# Altium schematic sheet TECS_DRIVER.SchDoc: TEC_DRIVER
size 420 x 297 mm; SheetNumber: 7; SheetTotal: 12
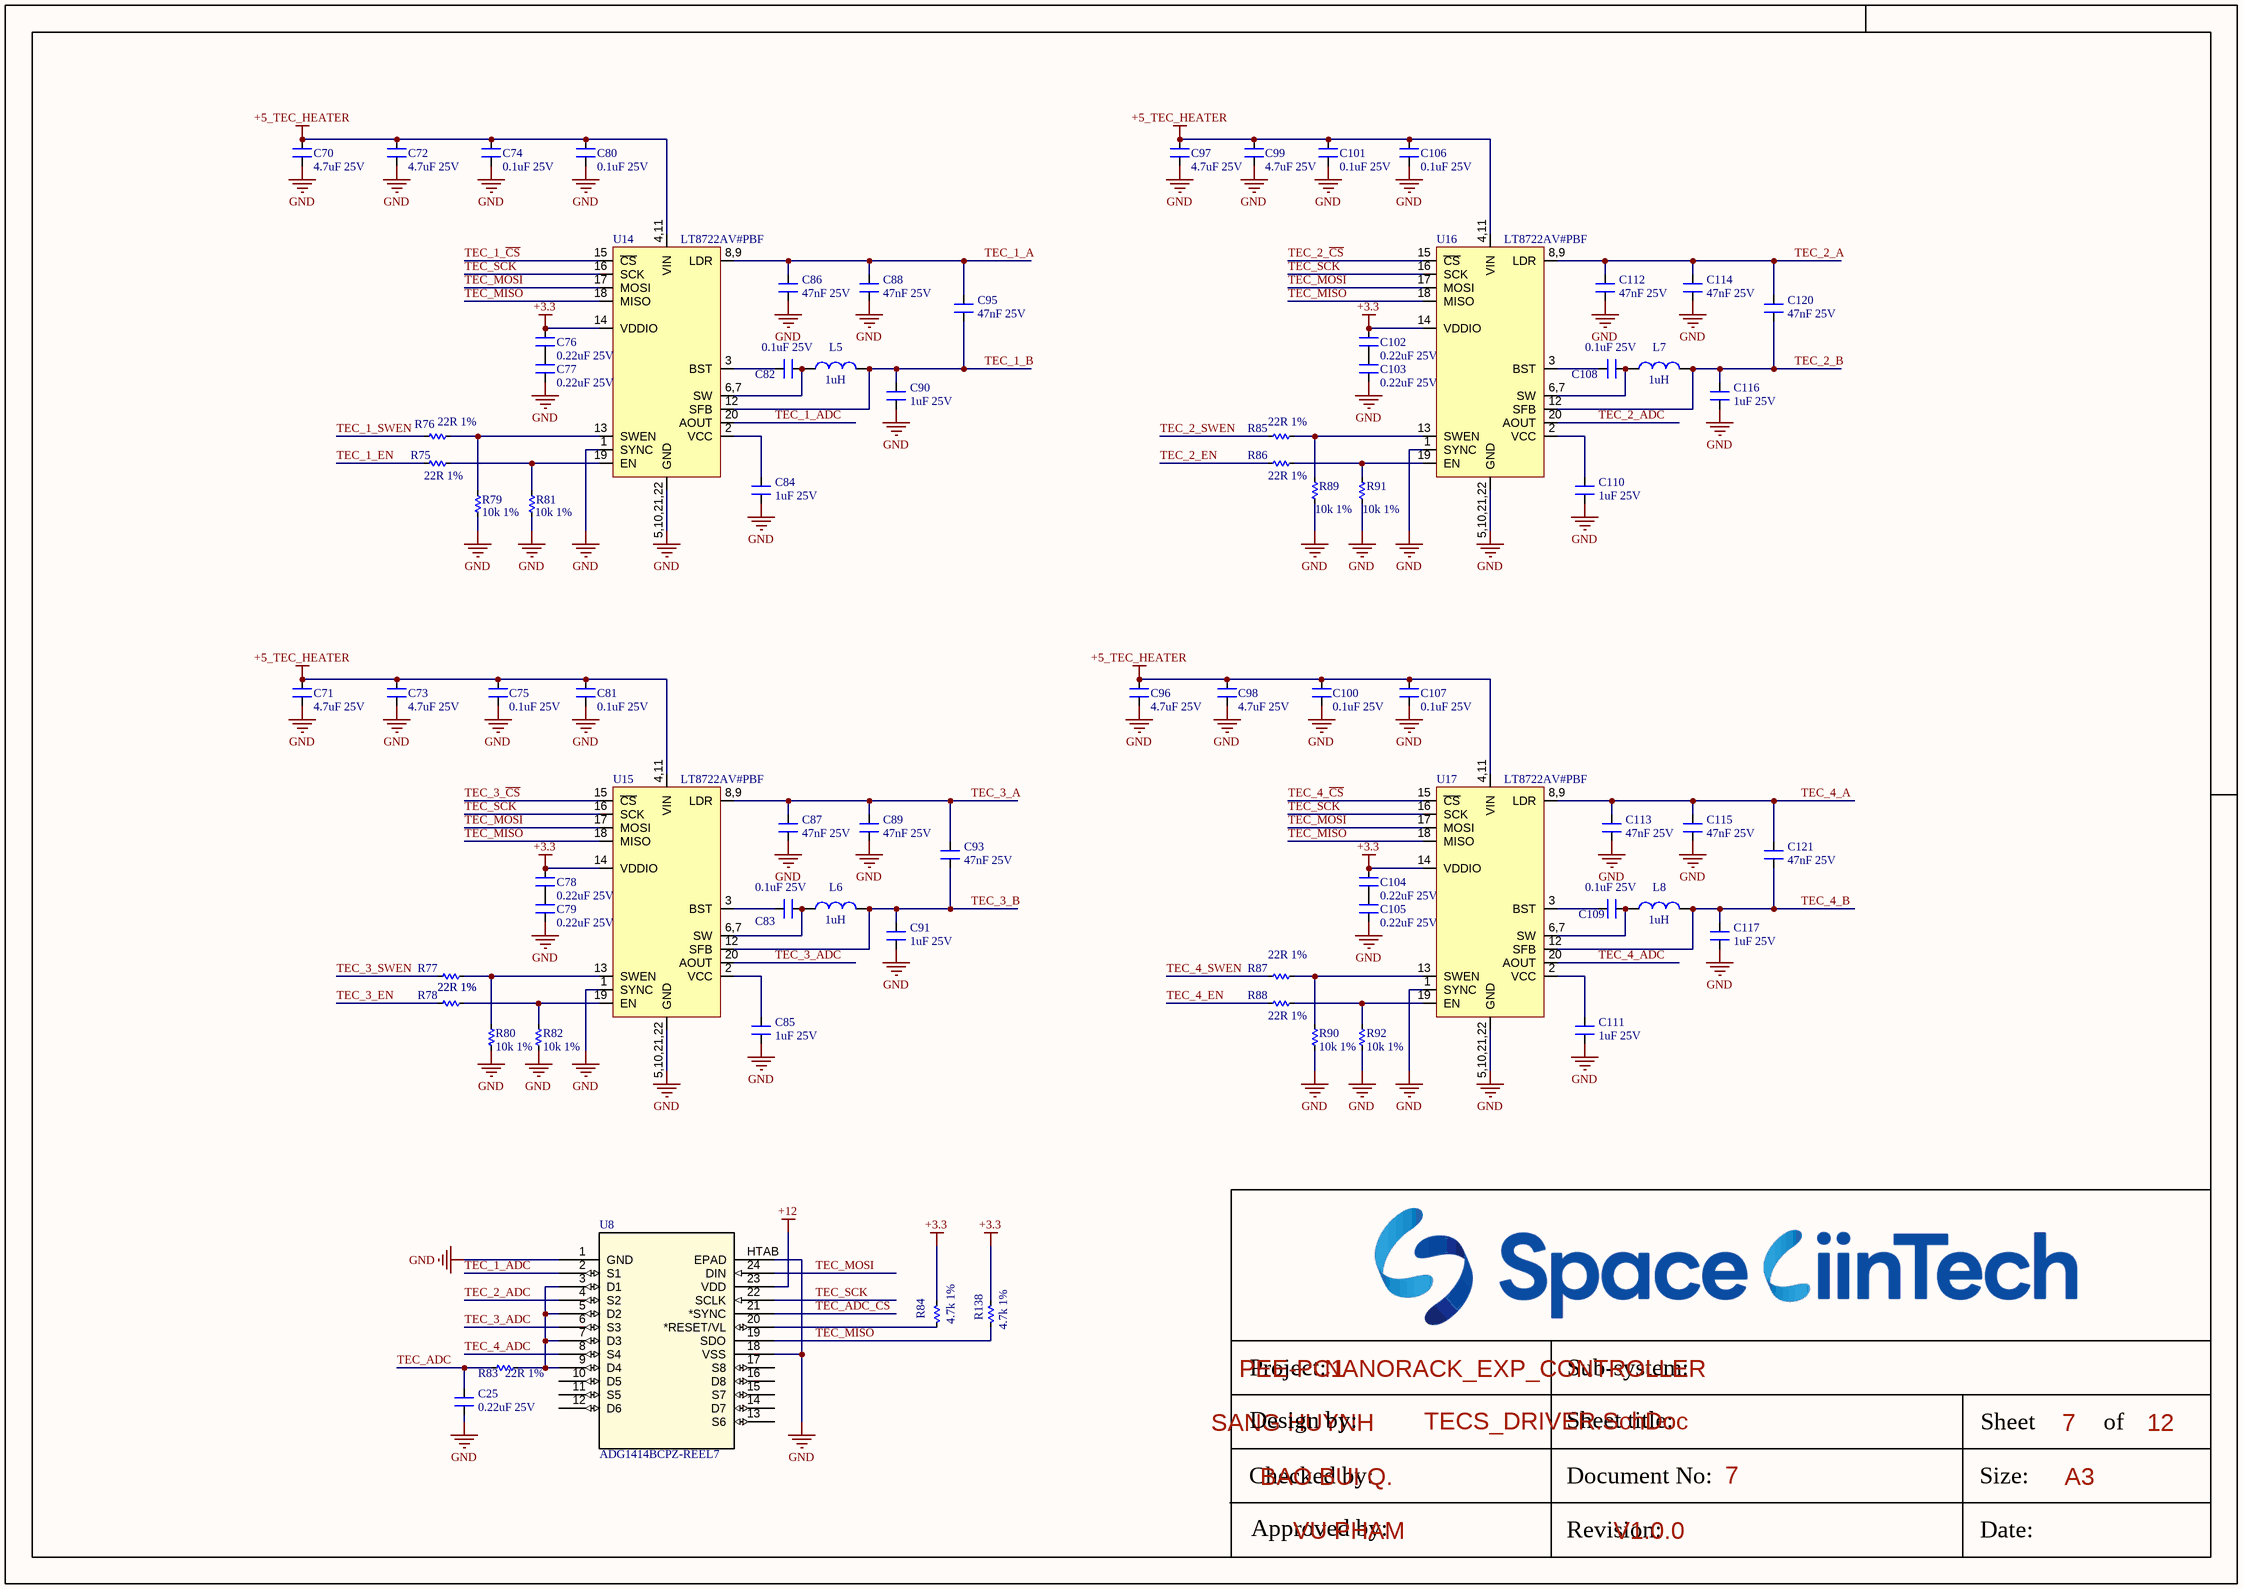
[diagram p0: TECS_DRIVER.SchDoc]

## Parts
C25  0.22uF 25V  [CN-SMD-0603-EXP-V101]
C70  4.7uF 25V  [CN-SMD-0603-EXP-V101]
C71  4.7uF 25V  [CN-SMD-0603-EXP-V101]
C72  4.7uF 25V  [CN-SMD-0603-EXP-V101]
C73  4.7uF 25V  [CN-SMD-0603-EXP-V101]
C74  0.1uF 25V  [CN-SMD-0603-EXP-V101]
C75  0.1uF 25V  [CN-SMD-0603-EXP-V101]
C76  0.22uF 25V  [CN-SMD-0603-EXP-V101]
C77  0.22uF 25V  [CN-SMD-0603-EXP-V101]
C78  0.22uF 25V  [CN-SMD-0603-EXP-V101]
C79  0.22uF 25V  [CN-SMD-0603-EXP-V101]
C80  0.1uF 25V  [CN-SMD-0603-EXP-V101]
C81  0.1uF 25V  [CN-SMD-0603-EXP-V101]
C82  0.1uF 25V  [CN-SMD-0603-EXP-V101]
C83  0.1uF 25V  [CN-SMD-0603-EXP-V101]
C84  1uF 25V  [CN-SMD-0603-EXP-V101]
C85  1uF 25V  [CN-SMD-0603-EXP-V101]
C86  47nF 25V  [CN-SMD-0603-EXP-V101]
C87  47nF 25V  [CN-SMD-0603-EXP-V101]
C88  47nF 25V  [CN-SMD-0603-EXP-V101]
C89  47nF 25V  [CN-SMD-0603-EXP-V101]
C90  1uF 25V  [CN-SMD-0603-EXP-V101]
C91  1uF 25V  [CN-SMD-0603-EXP-V101]
C93  47nF 25V  [CN-SMD-0603-EXP-V101]
C95  47nF 25V  [CN-SMD-0603-EXP-V101]
C96  4.7uF 25V  [CN-SMD-0603-EXP-V101]
C97  4.7uF 25V  [CN-SMD-0603-EXP-V101]
C98  4.7uF 25V  [CN-SMD-0603-EXP-V101]
C99  4.7uF 25V  [CN-SMD-0603-EXP-V101]
C100  0.1uF 25V  [CN-SMD-0603-EXP-V101]
C101  0.1uF 25V  [CN-SMD-0603-EXP-V101]
C102  0.22uF 25V  [CN-SMD-0603-EXP-V101]
C103  0.22uF 25V  [CN-SMD-0603-EXP-V101]
C104  0.22uF 25V  [CN-SMD-0603-EXP-V101]
C105  0.22uF 25V  [CN-SMD-0603-EXP-V101]
C106  0.1uF 25V  [CN-SMD-0603-EXP-V101]
C107  0.1uF 25V  [CN-SMD-0603-EXP-V101]
C108  0.1uF 25V  [CN-SMD-0603-EXP-V101]
C109  0.1uF 25V  [CN-SMD-0603-EXP-V101]
C110  1uF 25V  [CN-SMD-0603-EXP-V101]
C111  1uF 25V  [CN-SMD-0603-EXP-V101]
C112  47nF 25V  [CN-SMD-0603-EXP-V101]
C113  47nF 25V  [CN-SMD-0603-EXP-V101]
C114  47nF 25V  [CN-SMD-0603-EXP-V101]
C115  47nF 25V  [CN-SMD-0603-EXP-V101]
C116  1uF 25V  [CN-SMD-0603-EXP-V101]
C117  1uF 25V  [CN-SMD-0603-EXP-V101]
C120  47nF 25V  [CN-SMD-0603-EXP-V101]
C121  47nF 25V  [CN-SMD-0603-EXP-V101]
L5  1uH  [L-SMD-M-3.5x3.5x2mm-EXP-V101]
L6  1uH  [L-SMD-M-3.5x3.5x2mm-EXP-V101]
L7  1uH  [L-SMD-M-3.5x3.5x2mm-EXP-V101]
L8  1uH  [L-SMD-M-3.5x3.5x2mm-EXP-V101]
R75  22R 1%  [RES-SMD-0603-EXP-V101]
R76  22R 1%  [RES-SMD-0603-EXP-V101]
R77  22R 1%  [RES-SMD-0603-EXP-V101]
R78  22R 1%  [RES-SMD-0603-EXP-V101]
R79  10k 1%  [RES-SMD-0603-EXP-V101]
R80  10k 1%  [RES-SMD-0603-EXP-V101]
R81  10k 1%  [RES-SMD-0603-EXP-V101]
R82  10k 1%  [RES-SMD-0603-EXP-V101]
R83  22R 1%  [RES-SMD-0603-EXP-V101]
R84  4.7k 1%  [RES-SMD-0603-EXP-V101]
R85  22R 1%  [RES-SMD-0603-EXP-V101]
R86  22R 1%  [RES-SMD-0603-EXP-V101]
R87  22R 1%  [RES-SMD-0603-EXP-V101]
R88  22R 1%  [RES-SMD-0603-EXP-V101]
R89  10k 1%  [RES-SMD-0603-EXP-V101]
R90  10k 1%  [RES-SMD-0603-EXP-V101]
R91  10k 1%  [RES-SMD-0603-EXP-V101]
R92  10k 1%  [RES-SMD-0603-EXP-V101]
R138  4.7k 1%  [RES-SMD-0603-EXP-V101]
U8  ADG1414BCPZ-REEL7  [ADG1414BCPZ-REEL7]
U14  LT8722AV#PBF  [QFN18-EXP-V101]
U15  LT8722AV#PBF  [QFN18-EXP-V101]
U16  LT8722AV#PBF  [QFN18-EXP-V101]
U17  LT8722AV#PBF  [QFN18-EXP-V101]

## Nets
+3.3: C76.2 C78.2 C102.2 C104.2 R84.2 R138.2 U14.14(VDDIO) U15.14(VDDIO) U16.14(VDDIO) U17.14(VDDIO)
+5_TEC_HEATER: C70.2 C71.2 C72.2 C73.2 C74.2 C75.2 C80.2 C81.2 C96.2 C97.2 C98.2 C99.2 C100.2 C101.2 C106.2 C107.2 U14.4,11(VIN) U15.4,11(VIN) U16.4,11(VIN) U17.4,11(VIN)
+12: U8.23(VDD)
GND: C25.1 C70.1 C71.1 C72.1 C73.1 C74.1 C75.1 C77.1 C79.1 C80.1 C81.1 C84.1 C85.1 C86.1 C87.1 C88.1 C89.1 C90.1 C91.1 C96.1 C97.1 C98.1 C99.1 C100.1 C101.1 C103.1 C105.1 C106.1 C107.1 C110.1 C111.1 C112.1 C113.1 C114.1 C115.1 C116.1 C117.1 R79.2 R80.1 R81.2 R82.1 R89.2 R90.1 R91.2 R92.1 U8.1(GND) U8.18(VSS) U8.HTAB(EPAD) U14.1(SYNC) U14.5,10,21,22(GND) U15.1(SYNC) U15.5,10,21,22(GND) U16.1(SYNC) U16.5,10,21,22(GND) U17.1(SYNC) U17.5,10,21,22(GND)
TEC_1_A: C86.2 C88.2 C95.2 U14.8,9(LDR)
TEC_1_ADC: U8.2(S1) U14.20(AOUT)
TEC_1_B: C90.2 C95.1 L5.2 U14.12(SFB)
TEC_1_~{CS}: U14.15(~{CS})
TEC_1_EN: R75.1
TEC_1_SWEN: R76.1
TEC_2_A: C112.2 C114.2 C120.2 U16.8,9(LDR)
TEC_2_ADC: U8.4(S2) U16.20(AOUT)
TEC_2_B: C116.2 C120.1 L7.2 U16.12(SFB)
TEC_2_~{CS}: U16.15(~{CS})
TEC_2_EN: R86.1
TEC_2_SWEN: R85.1
TEC_3_A: C87.2 C89.2 C93.2 U15.8,9(LDR)
TEC_3_ADC: U8.6(S3) U15.20(AOUT)
TEC_3_B: C91.2 C93.1 L6.2 U15.12(SFB)
TEC_3_~{CS}: U15.15(~{CS})
TEC_3_EN: R78.1
TEC_3_SWEN: R77.1
TEC_4_A: C113.2 C115.2 C121.2 U17.8,9(LDR)
TEC_4_ADC: U8.8(S4) U17.20(AOUT)
TEC_4_B: C117.2 C121.1 L8.2 U17.12(SFB)
TEC_4_~{CS}: U17.15(~{CS})
TEC_4_EN: R88.1
TEC_4_SWEN: R87.1
TEC_ADC: C25.2 R83.1
TEC_ADC_~{CS}: U8.21(*SYNC)
TEC_MISO: R138.1 U8.19(SDO) U14.18(MISO) U15.18(MISO) U16.18(MISO) U17.18(MISO)
TEC_MOSI: U8.24(DIN) U14.17(MOSI) U15.17(MOSI) U16.17(MOSI) U17.17(MOSI)
TEC_SCK: U8.22(SCLK) U14.16(SCK) U15.16(SCK) U16.16(SCK) U17.16(SCK)
NetC76_1: C76.1 C77.2
NetC78_1: C78.1 C79.2
NetC82_1: C82.1 L5.1 U14.6,7(SW)
NetC82_2: C82.2 U14.3(BST)
NetC83_1: C83.1 L6.1 U15.6,7(SW)
NetC83_2: C83.2 U15.3(BST)
NetC84_2: C84.2 U14.2(VCC)
NetC85_2: C85.2 U15.2(VCC)
NetC102_1: C102.1 C103.2
NetC104_1: C104.1 C105.2
NetC108_1: C108.1 L7.1 U16.6,7(SW)
NetC108_2: C108.2 U16.3(BST)
NetC109_1: C109.1 L8.1 U17.6,7(SW)
NetC109_2: C109.2 U17.3(BST)
NetC110_2: C110.2 U16.2(VCC)
NetC111_2: C111.2 U17.2(VCC)
NetR75_2: R75.2 R81.1 U14.19(EN)
NetR76_2: R76.2 R79.1 U14.13(SWEN)
NetR77_2: R77.2 R80.2 U15.13(SWEN)
NetR78_2: R78.2 R82.2 U15.19(EN)
NetR83_2: R83.2 U8.3(D1) U8.5(D2) U8.7(D3) U8.9(D4)
NetR84_1: R84.1 U8.20(*RESET/VL)
NetR85_2: R85.2 R89.1 U16.13(SWEN)
NetR86_2: R86.2 R91.1 U16.19(EN)
NetR87_2: R87.2 R90.2 U17.13(SWEN)
NetR88_2: R88.2 R92.2 U17.19(EN)

Not connected (* = marked no-connect by the designer): U8 10(D5) 11(S5) 12(D6) 13(S6) 14(D7) 15(S7) 16(D8) 17(S8)

## Notes on the sheet
- Project:
- PEE-PC1
- Sub-system:
- NANORACK_EXP_CONTROLLER
- Design by:
- SANG HUYNH
- BAO BUI Q.
- Sheet title:
- Sheet
- A3
- of
- Checked by:
- Approved by:
- VU PHAM
- Revision:
- Document No:
- V1.0.0
- Size:
- Date:

## Library data of the parts
C25 C70-C91 C93 C95-C117 C120 C121 = Capacitors: Value: 33pF
L5-L8 = L-SMD-1: partNo: 78477010; Manufacturer: Wurth Elektronik; Inductance: 1.0 μH; ComponentLink1Description: Manufacturer; ComponentLink1URL: http://www.we-online.de; Created by: Baojun Chen; Created Date: Nov.2015; ComponentLink2Description: Datasheet; ComponentLink2URL: http://katalog.we-online.de/pbs/datasheet/78477010.pdf
R75-R92 R138 = Res SMD: SMD; Manufacturer: Generic Components; Class: Passive; Published: 08/06/2000; Publisher: Altium Hobart Technology Centre
U8 = ADG1414: IC SW SPST-NOX8 11.5OHM 24LFCSP
U14-U17 = LT8722